# Altium schematic sheet Output.SchDoc: OUTPUT
size A4
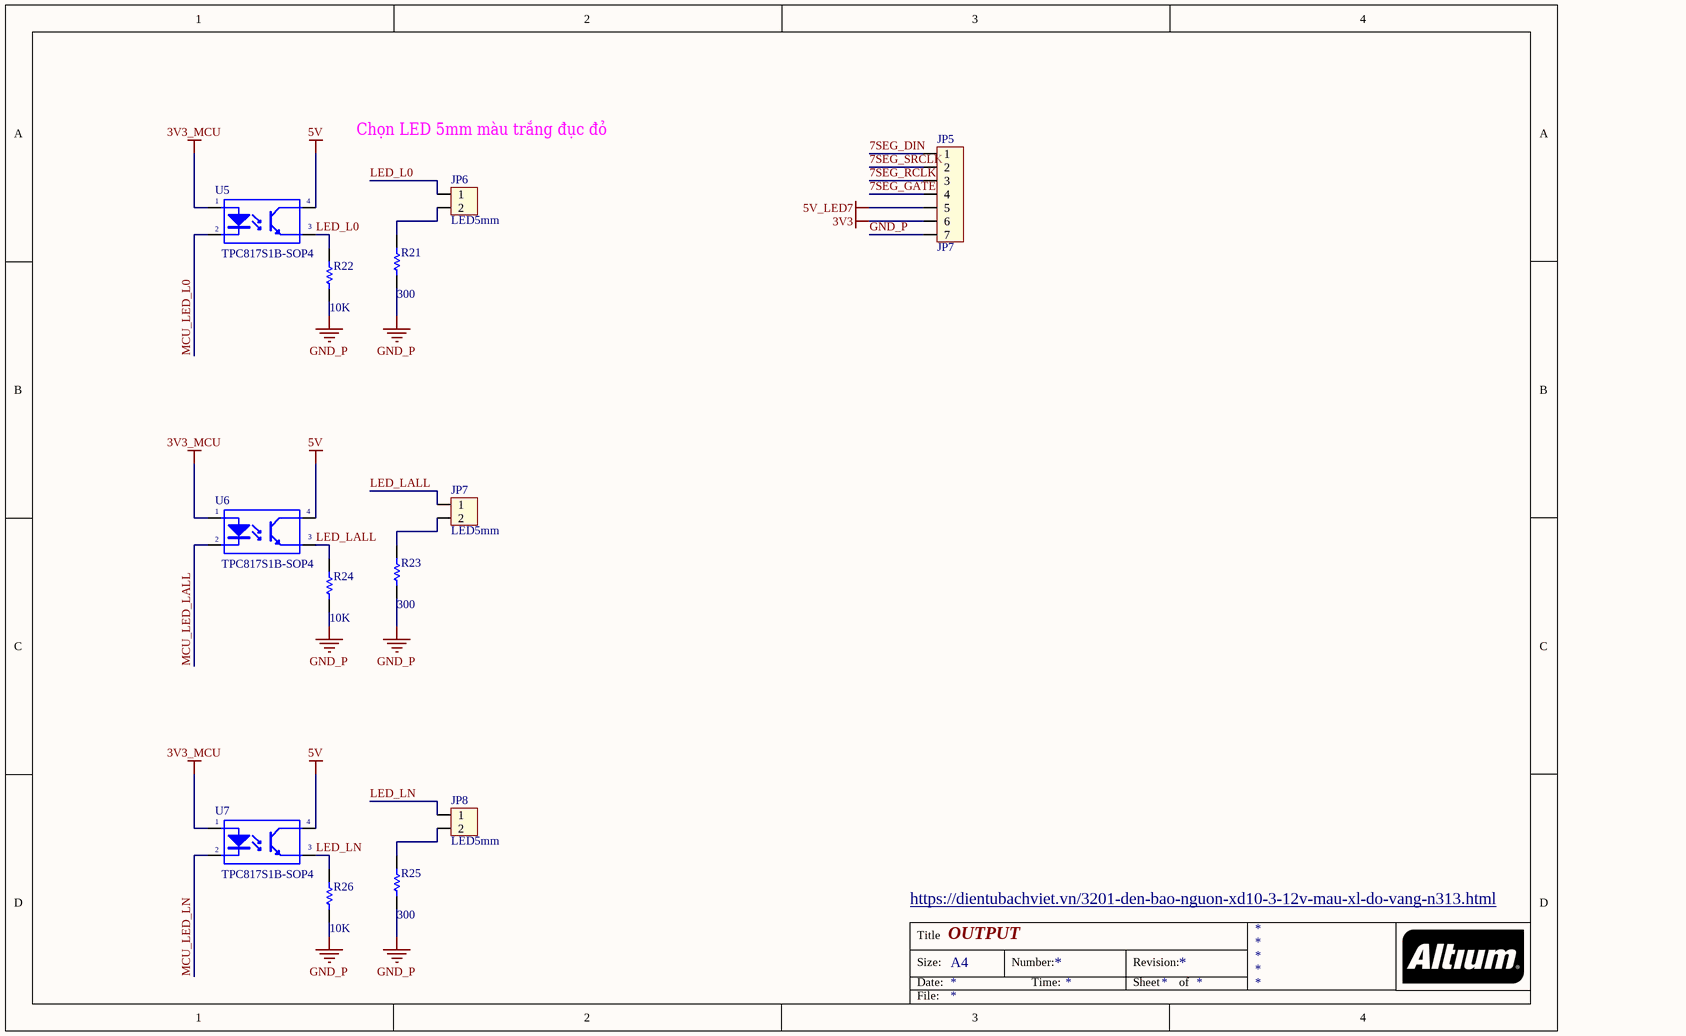
[diagram p0: Output.SchDoc]

## Parts
JP5  JP7  [CON7]
JP6  LED5mm  [CON2]
JP7  LED5mm  [CON2]
JP8  LED5mm  [CON2]
R21  300  [Res 0805 SMD]
R22  10K  [Res 0805 SMD]
R23  300  [Res 0805 SMD]
R24  10K  [Res 0805 SMD]
R25  300  [Res 0805 SMD]
R26  10K  [Res 0805 SMD]
U5  TPC817S1B-SOP4  [TPC817-4SOP]
U6  TPC817S1B-SOP4  [TPC817-4SOP]
U7  TPC817S1B-SOP4  [TPC817-4SOP]

## Nets
3V3: JP5.6
3V3_MCU: U5.1(A) U6.1(A) U7.1(A)
5V: U5.4(C) U6.4(C) U7.4(C)
5V_LED7: JP5.5
GND_P: JP5.7 R21.1 R22.1 R23.1 R24.1 R25.1 R26.1
7SEG_DIN: JP5.1
7SEG_GATE: JP5.4
7SEG_RCLK: JP5.3
7SEG_SRCLK: JP5.2
LED_L0: JP6.1 R22.2 U5.3(E)
LED_LALL: JP7.1 R24.2 U6.3(E)
LED_LN: JP8.1 R26.2 U7.3(E)
MCU_LED_L0: U5.2(K)
MCU_LED_LALL: U6.2(K)
MCU_LED_LN: U7.2(K)
NetJP6_2: JP6.2 R21.2
NetJP7_2: JP7.2 R23.2
NetJP8_2: JP8.2 R25.2

## Notes on the sheet
- Chọn LED 5mm màu trắng đục đỏ
- https://dientubachviet.vn/3201-den-bao-nguon-xd10-3-12v-mau-xl-do-vang-n313.html
- Title
- Size:
- Date:
- A4
- Number:
- Time:
- Revision:
- Sheet
- of
- File:

## Library data of the parts
JP5 = Con7: Connector 7; Value: Connector 7
JP6-JP8 = Con2: Connector 2; Value: Connector 2
R21-R26 = 249K/R0805/1%: RES SMD 249K OHM 1% 1/10W 0805; Manufacturer: Yageo; Manufacturer Part Number: RC0603FR-07249KL; Power (Watts): 0.1W, 1/10W; Temperature Coefficient: ±100ppm/°C; Supplier 1: Digi-Key; RoHS: RoHS Compliant; Category: Resistors; Stock 1: 370515; Pricing 1: 1=0.1, 10=0.015, 100=0.006, 1000=0.00268, 2500=0.00233 (USD); Packaging: Cut Tape (CT); Part Status: Active; Tolerance: ±1%; Composition: Thick Film; Features: Moisture Resistant; Operating Temperature: -55°C ~ 155°C; Package / Case: 0603 (1608 Metric); Supplier Device Package: 0603; Size / Dimension: 0.063" L x 0.032" W (1.60mm x 0.80mm); Height - Seated (Max): 0.022" (0.55mm); Failure Rate: -; ComponentLink1URL: http://www.yageo.com/documents/recent/PYu-RC_Group_51_RoHS_L_8.pdf; ComponentLink1Description: http://www.yageo.com/documents/recent/PYu-RC_Group_51_RoHS_L_8.pdf
U5-U7 = PC817: Optoisolator Transistor Output 5000Vrms 1 Channel 4-SOP; Digikey: TPC817S1BRAGCT-ND